# Altium schematic sheet fourLEDS.SchDoc
size A4; SPICEModelCacheZSWKOIMU: <root> / <DocumentId>ZSWKOIMU</DocumentId> / <CacheFrame Number="0"> / <Model Name="led3" Kind="MDL"> / <Text>*Typ BLUE SiC LED: Vf=3.4V Vr=5V If=40mA trr=3uS / *LED Pinout: 1=A, 2=K / .MODEL LED3 D (IS=93.1P RS=42M N=7.47 BV=5 IBV=30U / + CJO=2.97P VJ=.75 M=.333 TT=4.32U)</Text> / </Model> / <Model Name="led1" Kind="MDL"> / <Text>*Typ RED GaAs LED: Vf=1.7V Vr=4V If=40mA trr=3uS / *LED Pinout: 1=A, 2=K / .MODEL LED1 D (IS=93.2P RS=42M N=3.73 BV=4 IBV=10U / + CJO=2.97P VJ=.75 M=.333 TT=4.32U)</Text> / </Model> / </CacheFrame> / </root>
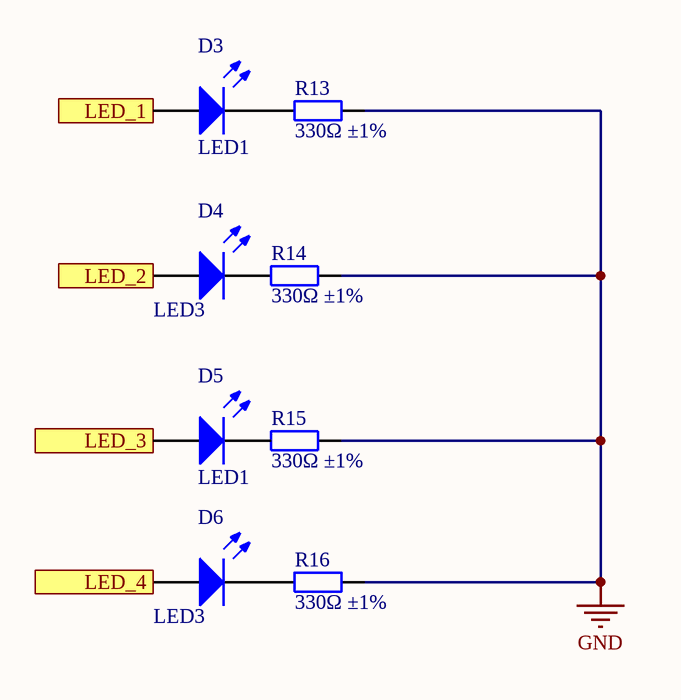
[diagram p0: fourLEDS.SchDoc]

## Parts
D3  LED1  [LED-1]
D4  LED3  [3.5X2.8X1.9]
D5  LED1  [LED-1]
D6  LED3  [3.5X2.8X1.9]
R13  330Ω ±1%  [0603_R]
R14  330Ω ±1%  [0603_R]
R15  330Ω ±1%  [0603_R]
R16  330Ω ±1%  [0603_R]

## Ports
LED_1, LED_2, LED_3, LED_4

## Nets
GND: R13.2 R14.2 R15.2 R16.2
LED_1: D3.1(A) ; port LED_1
LED_2: D4.1(A) ; port LED_2
LED_3: D5.1(A) ; port LED_3
LED_4: D6.1(A) ; port LED_4
NetD3_2: D3.2(K) R13.1
NetD6_2: D6.2(K) R16.1

Not connected (* = marked no-connect by the designer): D4 2(K); D5 2(K); R14 1; R15 1

## Library data of the parts
D3 D5 = LED1: Typical RED GaAs LED; Published: 8-Jun-2000; LatestRevisionDate: 08-Jul-2005; LatestRevisionNote: Mech Layer 1 removed.; PackageReference: LED-1; Publisher: Altium Limited; PackageDescription: LED; 2 Leads
D4 D6 = LED3: Typical BLUE SiC LED; Published: 8-Jun-2000; LatestRevisionDate: 17-Dec-2003; LatestRevisionNote: PCB Footprint replaced.; DatasheetVersion: 16-Apr-2002; PackageVersion: 16-Apr-2002; PackageReference: 3.5X2.8X1.9; Publisher: Altium Limited; PackageDescription: SM LED; 2 C-Bend Leads; Body 3.5 x 2.8 x 1.9 mm, inc leads (LxWxH typ)
R13-R16 = 0603 330R (3300) 1%: Chip resistor; Manufacturer: Uniroyal Elec; PartNumber: 0603WAF3300T5E; Power: 1/10W; ComponentLink1Description: Supplier link; ComponentLink1URL: http://www.szlcsc.com/product/details_23865.html; Package: 0603; Supplier: LC; SuppliersPartNumber: C23138; Resistance: 330Ω; Tolerance: 1%